# Altium schematic sheet CON_SODIMM_200PIN_MO-224_NEW.SchDoc: SODIMM 200Pin
size A4
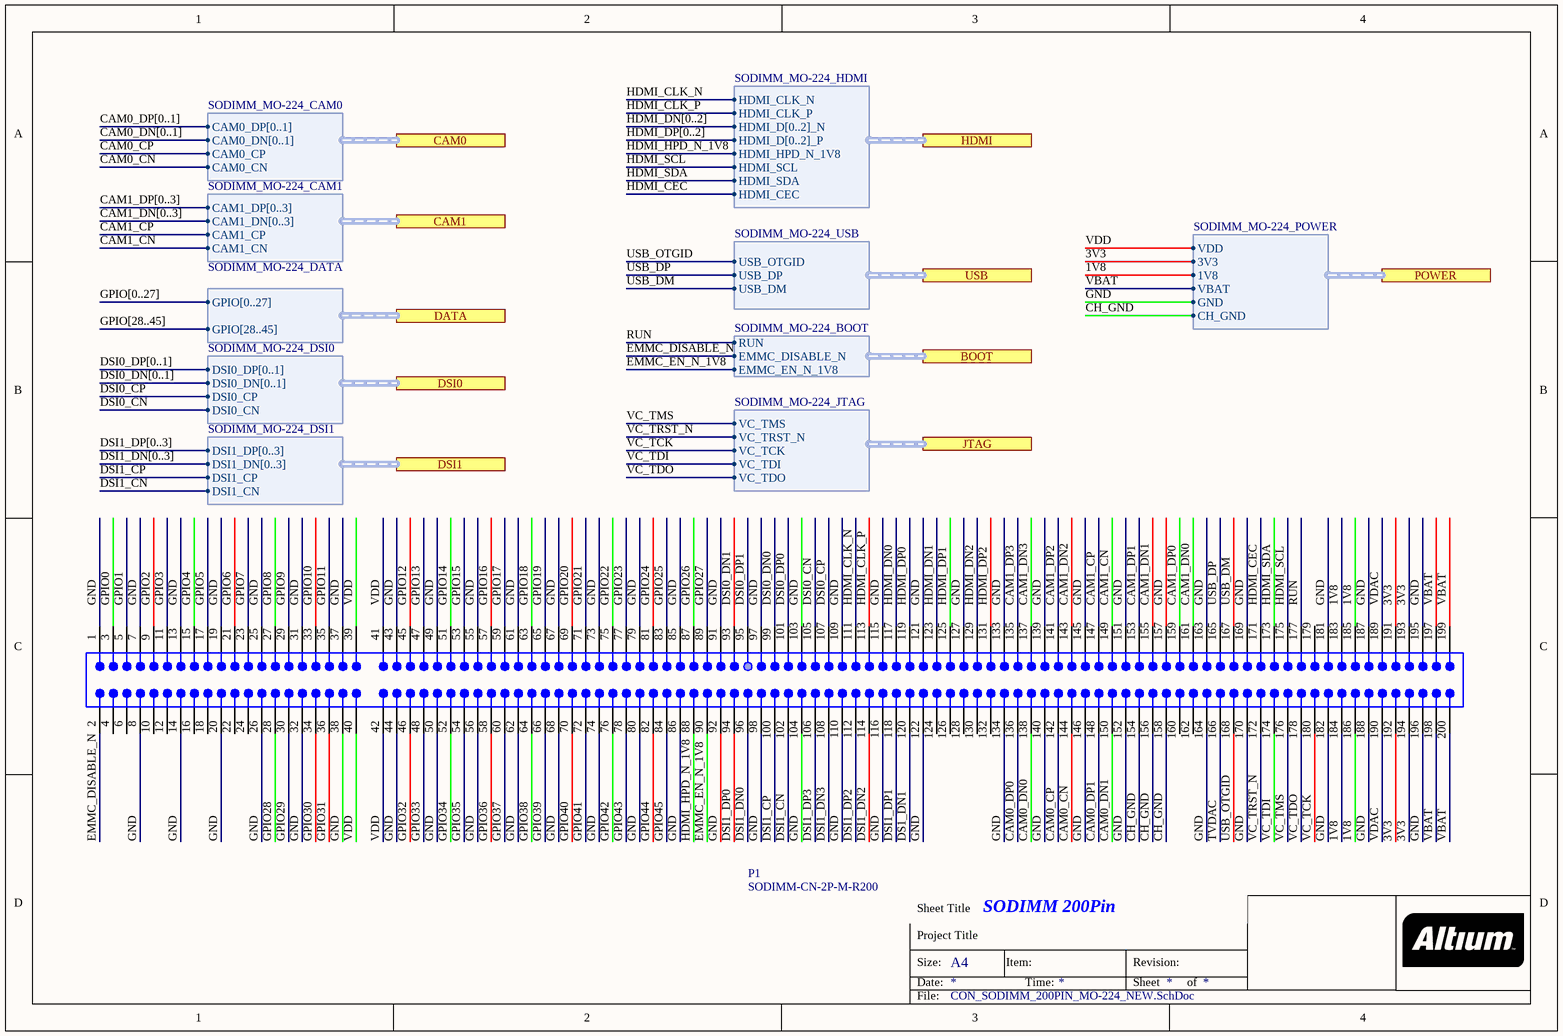
[diagram p0: CON_SODIMM_200PIN_MO-224_NEW.SchDoc]

## Parts
P1  SODIMM-CN-2P-M-R200  [SODIMM-GF-2D-600-1K-S200]  (no BOM)

## Ports
BOOT (harness SODIMM_MO-224_BOOT), CAM0 (harness SODIMM_MO-224_CAM0), CAM1 (harness SODIMM_MO-224_CAM1), DATA (harness SODIMM_MO-224_DATA), DSI0 (harness SODIMM_MO-224_DSI0), DSI1 (harness SODIMM_MO-224_DSI1), HDMI (harness SODIMM_MO-224_HDMI), JTAG (harness SODIMM_MO-224_JTAG), POWER (harness SODIMM_MO-224_POWER), USB (harness SODIMM_MO-224_USB)

## Harnesses
SODIMM_MO-224_CAM0: CAM0_DP[0..1], CAM0_DN[0..1], CAM0_CP, CAM0_CN
SODIMM_MO-224_DATA: GPIO[0..27], GPIO[28..45]
SODIMM_MO-224_HDMI: HDMI_CLK_N, HDMI_CLK_P, HDMI_D[0..2]_N, HDMI_D[0..2]_P, HDMI_SCL, HDMI_SDA, HDMI_CEC, HDMI_HPD_N_1V8
SODIMM_MO-224_USB: USB_OTGID, USB_DP, USB_DM
SODIMM_MO-224_BOOT: RUN, EMMC_DISABLE_N, EMMC_EN_N_1V8
SODIMM_MO-224_POWER: VDD, 3V3, 1V8, VBAT, GND, CH_GND
SODIMM_MO-224_JTAG: VC_TMS, VC_TRST_N, VC_TCK, VC_TDI, VC_TDO
SODIMM_MO-224_CAM1: CAM1_DP[0..3], CAM1_DN[0..3], CAM1_CP, CAM1_CN
SODIMM_MO-224_DSI0: DSI0_DP[0..1], DSI0_DN[0..1], DSI0_CP, DSI0_CN
SODIMM_MO-224_DSI1: DSI1_DP[0..3], DSI1_DN[0..3], DSI1_CP, DSI1_CN

## Nets
1V8: P1.183 P1.184 P1.185 P1.186 ; port POWER.1V8
3V3: P1.191 P1.192 P1.193 P1.194 ; port POWER.3V3
CAM0_CN: P1.144 ; port CAM0.CAM0_CN
CAM0_CP: P1.142 ; port CAM0.CAM0_CP
CAM0_DN0: P1.138
CAM0_DN1: P1.150
CAM0_DP0: P1.136
CAM0_DP1: P1.148
CAM1_CN: P1.149 ; port CAM1.CAM1_CN
CAM1_CP: P1.147 ; port CAM1.CAM1_CP
CAM1_DN0: P1.161
CAM1_DN1: P1.155
CAM1_DN2: P1.143
CAM1_DN3: P1.137
CAM1_DP0: P1.159
CAM1_DP1: P1.153
CAM1_DP2: P1.141
CAM1_DP3: P1.135
CH_GND: P1.154 P1.156 P1.158 ; port POWER.CH_GND
DS1_DN1: P1.120
DSI0_CN: P1.105 ; port DSI0.DSI0_CN
DSI0_CP: P1.107 ; port DSI0.DSI0_CP
DSI0_DN0: P1.99
DSI0_DN1: P1.93
DSI0_DP0: P1.101
DSI0_DP1: P1.95
DSI1_CN: P1.102 ; port DSI1.DSI1_CN
DSI1_CP: P1.100 ; port DSI1.DSI1_CP
DSI1_DN0: P1.96
DSI1_DN2: P1.114
DSI1_DN3: P1.108
DSI1_DP0: P1.94
DSI1_DP1: P1.118
DSI1_DP2: P1.112
DSI1_DP3: P1.106
EMMC_DISABLE_N: P1.2 ; port BOOT.EMMC_DISABLE_N
EMMC_EN_N_1V8: P1.90 ; port BOOT.EMMC_EN_N_1V8
GND: P1.1 P1.7 P1.8 P1.13 P1.14 P1.19 P1.20 P1.25 P1.26 P1.31 P1.32 P1.37 P1.38 P1.43 P1.44 P1.49 P1.50 P1.55 P1.56 P1.61 P1.62 P1.67 P1.68 P1.73 P1.74 P1.79 P1.80 P1.85 P1.86 P1.91 P1.92 P1.97 P1.98 P1.103 P1.104 P1.109 P1.110 P1.115 P1.116 P1.121 P1.122 P1.127 P1.133 P1.134 P1.139 P1.140 P1.145 P1.146 P1.151 P1.152 P1.157 P1.163 P1.164 P1.169 P1.170 P1.181 P1.182 P1.187 P1.188 P1.195 P1.196 ; port POWER.GND
GPIO0: P1.3
GPIO1: P1.5
GPIO2: P1.9
GPIO3: P1.11
GPIO4: P1.15
GPIO5: P1.17
GPIO6: P1.21
GPIO7: P1.23
GPIO8: P1.27
GPIO9: P1.29
GPIO10: P1.33
GPIO11: P1.35
GPIO12: P1.45
GPIO13: P1.47
GPIO14: P1.51
GPIO15: P1.53
GPIO16: P1.57
GPIO17: P1.59
GPIO18: P1.63
GPIO19: P1.65
GPIO20: P1.69
GPIO21: P1.71
GPIO22: P1.75
GPIO23: P1.77
GPIO24: P1.81
GPIO25: P1.83
GPIO26: P1.87
GPIO27: P1.89
GPIO28: P1.28
GPIO29: P1.30
GPIO30: P1.34
GPIO31: P1.36
GPIO32: P1.46
GPIO33: P1.48
GPIO34: P1.52
GPIO35: P1.54
GPIO36: P1.58
GPIO37: P1.60
GPIO38: P1.64
GPIO39: P1.66
GPIO40: P1.70
GPIO41: P1.72
GPIO42: P1.76
GPIO43: P1.78
GPIO44: P1.82
GPIO45: P1.84
HDMI_CEC: P1.171 ; port HDMI.HDMI_CEC
HDMI_CLK_N: P1.111 ; port HDMI.HDMI_CLK_N
HDMI_CLK_P: P1.113 ; port HDMI.HDMI_CLK_P
HDMI_DN0: P1.117
HDMI_DN1: P1.123
HDMI_DN2: P1.129
HDMI_DP0: P1.119
HDMI_DP1: P1.125
HDMI_DP2: P1.131
HDMI_HPD_N_1V8: P1.88 ; port HDMI.HDMI_HPD_N_1V8
HDMI_SCL: P1.175 ; port HDMI.HDMI_SCL
HDMI_SDA: P1.173 ; port HDMI.HDMI_SDA
RUN: P1.177 ; port BOOT.RUN
TVDAC: P1.166
USB_DM: P1.167 ; port USB.USB_DM
USB_DP: P1.165 ; port USB.USB_DP
USB_OTGID: P1.168 ; port USB.USB_OTGID
VBAT: P1.197 P1.198 P1.199 P1.200 ; port POWER.VBAT
VC_TCK: P1.180 ; port JTAG.VC_TCK
VC_TDI: P1.174 ; port JTAG.VC_TDI
VC_TDO: P1.178 ; port JTAG.VC_TDO
VC_TMS: P1.176 ; port JTAG.VC_TMS
VC_TRST_N: P1.172 ; port JTAG.VC_TRST_N
VDAC: P1.189 P1.190
VDD: P1.39 P1.40 P1.41 P1.42 ; port POWER.VDD

Not connected (* = marked no-connect by the designer): P1 4 6 10 12 16 18 22 24 124 126 128 130 132 160 162 179

## Buses and harness runs
bus CAM0_DN[0..1]
bus CAM0_DP[0..1]
bus CAM1_DN[0..3]
bus CAM1_DP[0..3]
bus DSI0_DN[0..1]
bus DSI0_DP[0..1]
bus DSI1_DN[0..3]
bus DSI1_DP[0..3]
bus GPIO[0..27]
bus GPIO[28..45]
bus HDMI_DN[0..2]
bus HDMI_DP[0..2]

## Notes on the sheet
- Sheet Title
- Project Title
- Size:
- Date:
- A4
- Item:
- Time:
- Revision:
- Sheet
- of
- File:

## Library data of the parts
P1 = CMP-0001-00060-2: Golden finger, SODIMM, Dual, Staggered, Pitch 0.6mm, 200-Position; Mating Connector: Tyco-6-1473005-1; Publisher: Altium; ClassName: Edge Connector; Package Reference: SODIMM-GF-2D-600-1K-S200